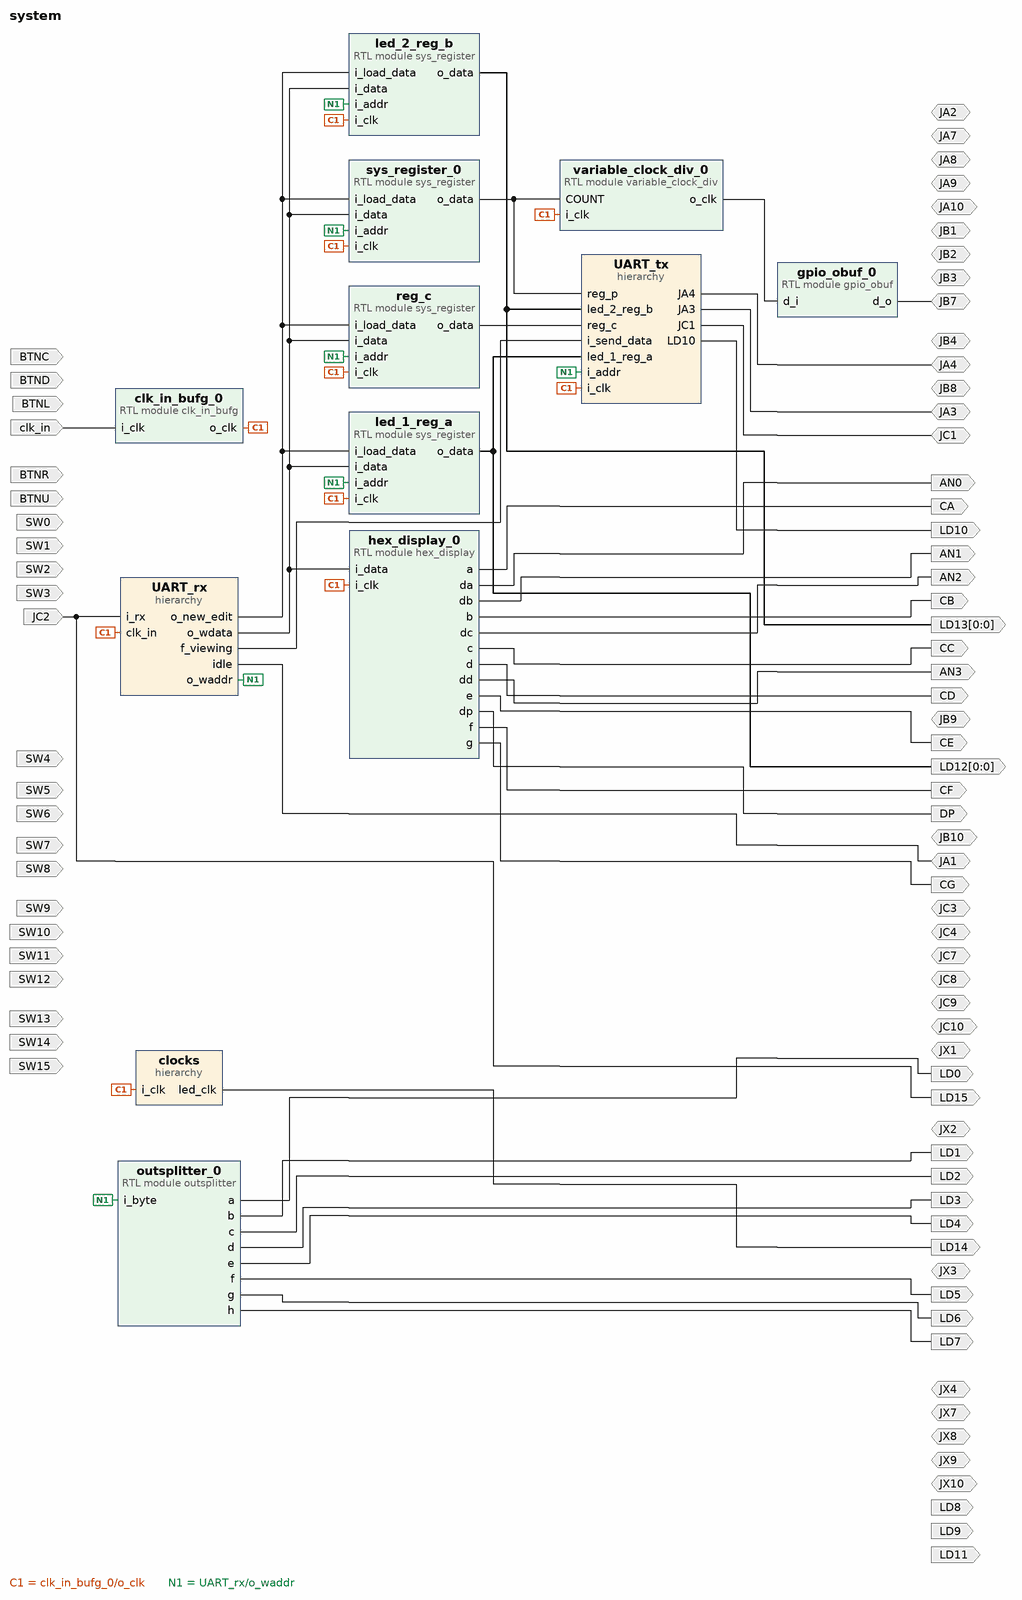
[diagram p0: block diagram of the top level]
# Vivado block design system, xc7a35tcpg236-1, Vivado 2022.1
create_bd_design system

create_bd_port -dir I BTNL
create_bd_port -dir I BTNR
create_bd_port -dir I BTNU
create_bd_port -dir I BTND
create_bd_port -dir I BTNC
create_bd_port -dir I SW0
create_bd_port -dir I SW1
create_bd_port -dir I SW2
create_bd_port -dir I SW3
create_bd_port -dir I SW4
create_bd_port -dir I SW5
create_bd_port -dir I SW6
create_bd_port -dir I SW7
create_bd_port -dir I SW8
create_bd_port -dir I SW9
create_bd_port -dir I SW10
create_bd_port -dir I SW11
create_bd_port -dir I SW12
create_bd_port -dir I SW13
create_bd_port -dir I SW14
create_bd_port -dir I SW15
create_bd_port -dir O AN0
create_bd_port -dir O AN1
create_bd_port -dir O AN2
create_bd_port -dir O AN3
create_bd_port -dir O CA
create_bd_port -dir O CB
create_bd_port -dir O CC
create_bd_port -dir O CD
create_bd_port -dir O CE
create_bd_port -dir O CF
create_bd_port -dir O CG
create_bd_port -dir O DP
create_bd_port -dir O LD0
create_bd_port -dir O LD1
create_bd_port -dir O LD2
create_bd_port -dir O LD3
create_bd_port -dir O LD4
create_bd_port -dir O LD5
create_bd_port -dir O LD6
create_bd_port -dir O LD7
create_bd_port -dir O LD8
create_bd_port -dir O LD9
create_bd_port -dir O LD10
create_bd_port -dir O LD11
create_bd_port -dir O -from 0 -to 0 LD12
create_bd_port -dir O -from 0 -to 0 LD13
create_bd_port -dir O LD14
create_bd_port -dir O LD15
create_bd_port -dir IO JA1
create_bd_port -dir IO JA2
create_bd_port -dir IO JA3
create_bd_port -dir IO JA4
create_bd_port -dir IO JA7
create_bd_port -dir IO JA8
create_bd_port -dir IO JA9
create_bd_port -dir IO JA10
create_bd_port -dir IO JB1
create_bd_port -dir IO JB2
create_bd_port -dir IO JB3
create_bd_port -dir IO JB4
create_bd_port -dir IO JB7
create_bd_port -dir IO JB8
create_bd_port -dir IO JB9
create_bd_port -dir IO JB10
create_bd_port -dir IO JC1
create_bd_port -dir IO JC3
create_bd_port -dir IO JC4
create_bd_port -dir IO JC7
create_bd_port -dir IO JC8
create_bd_port -dir IO JC9
create_bd_port -dir IO JC10
create_bd_port -dir IO JX1
create_bd_port -dir IO JX2
create_bd_port -dir IO JX3
create_bd_port -dir IO JX4
create_bd_port -dir IO JX7
create_bd_port -dir IO JX8
create_bd_port -dir IO JX9
create_bd_port -dir IO JX10
create_bd_port -dir I clk_in
create_bd_port -dir I JC2

create_bd_cell -type module -reference clk_in_bufg clk_in_bufg_0
create_bd_cell -type hier clocks
create_bd_cell -type hier UART_rx
create_bd_cell -type module -reference outsplitter outsplitter_0
create_bd_cell -type module -reference hex_display hex_display_0
create_bd_cell -type module -reference sys_register led_1_reg_a
set_property -dict {CONFIG.ADDR 97 CONFIG.OUTWIDTH 1} [get_bd_cells led_1_reg_a]
create_bd_cell -type module -reference sys_register led_2_reg_b
set_property -dict {CONFIG.ADDR 98 CONFIG.OUTWIDTH 1} [get_bd_cells led_2_reg_b]
create_bd_cell -type module -reference sys_register reg_c
set_property -dict {CONFIG.ADDR 99} [get_bd_cells reg_c]
create_bd_cell -type hier UART_tx
create_bd_cell -type module -reference sys_register sys_register_0
set_property -dict {CONFIG.ADDR 112 CONFIG.OUTWIDTH 32} [get_bd_cells sys_register_0]
create_bd_cell -type module -reference variable_clock_div variable_clock_div_0
set_property -dict {CONFIG.COUNT_WIDTH 32} [get_bd_cells variable_clock_div_0]
create_bd_cell -type module -reference gpio_obuf gpio_obuf_0

# ---- hierarchy /clocks ----
current_bd_instance /clocks
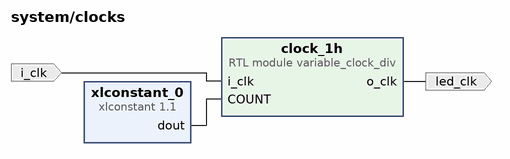
[diagram p1: block diagram inside /clocks]
create_bd_pin -dir I -type clk i_clk
create_bd_pin -dir O -type clk led_clk

create_bd_cell -type ip -vlnv xilinx.com:ip:xlconstant:1.1 xlconstant_0
set_property -dict {CONFIG.CONST_VAL 50000000 CONFIG.CONST_WIDTH 26} [get_bd_cells xlconstant_0]
create_bd_cell -type module -reference variable_clock_div clock_1h
set_property -dict {CONFIG.COUNT_WIDTH 26} [get_bd_cells clock_1h]

# ---- hierarchy /UART_rx ----
current_bd_instance /UART_rx
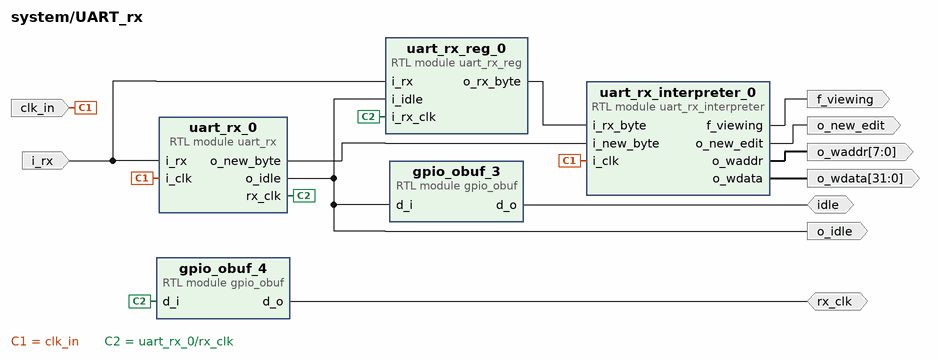
[diagram p2: block diagram inside /UART_rx]
create_bd_pin -dir I -type clk clk_in
create_bd_pin -dir I i_rx
create_bd_pin -dir IO rx_clk
create_bd_pin -dir IO idle
create_bd_pin -dir O o_idle
create_bd_pin -dir O o_new_edit
create_bd_pin -dir O -from 7 -to 0 o_waddr
create_bd_pin -dir O -from 31 -to 0 o_wdata
create_bd_pin -dir O f_viewing

create_bd_cell -type module -reference gpio_obuf gpio_obuf_4
create_bd_cell -type module -reference gpio_obuf gpio_obuf_3
create_bd_cell -type module -reference uart_rx uart_rx_0
create_bd_cell -type module -reference uart_rx_reg uart_rx_reg_0
create_bd_cell -type module -reference uart_rx_interpreter uart_rx_interpreter_0

# ---- hierarchy /UART_tx ----
current_bd_instance /UART_tx
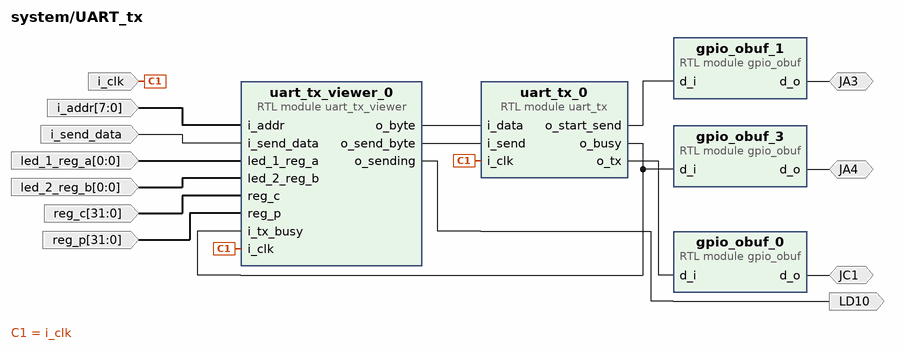
[diagram p3: block diagram inside /UART_tx]
create_bd_pin -dir I i_send_data
create_bd_pin -dir I -from 7 -to 0 i_addr
create_bd_pin -dir I -from 0 -to 0 led_1_reg_a
create_bd_pin -dir I -from 0 -to 0 led_2_reg_b
create_bd_pin -dir I -from 31 -to 0 reg_c
create_bd_pin -dir I -type clk i_clk
create_bd_pin -dir O LD10
create_bd_pin -dir IO JA4
create_bd_pin -dir IO JA3
create_bd_pin -dir IO JC1
create_bd_pin -dir I -from 31 -to 0 reg_p

create_bd_cell -type module -reference uart_tx uart_tx_0
create_bd_cell -type module -reference gpio_obuf gpio_obuf_3
create_bd_cell -type module -reference gpio_obuf gpio_obuf_1
create_bd_cell -type module -reference gpio_obuf gpio_obuf_0
create_bd_cell -type module -reference uart_tx_viewer uart_tx_viewer_0

# ---- connections ----

current_bd_instance /clocks
connect_bd_net [get_bd_pins i_clk] [get_bd_pins clock_1h/i_clk]
connect_bd_net -net variable_clock_div_1_o_clk [get_bd_pins clock_1h/o_clk] [get_bd_pins led_clk]
connect_bd_net [get_bd_pins xlconstant_0/dout] [get_bd_pins clock_1h/COUNT]

current_bd_instance /UART_rx
connect_bd_net -net JC2_1 [get_bd_pins i_rx] [get_bd_pins uart_rx_0/i_rx] [get_bd_pins uart_rx_reg_0/i_rx]
connect_bd_net [get_bd_pins rx_clk] [get_bd_pins gpio_obuf_4/d_o]
connect_bd_net [get_bd_pins idle] [get_bd_pins gpio_obuf_3/d_o]
connect_bd_net [get_bd_pins clk_in] [get_bd_pins uart_rx_0/i_clk] [get_bd_pins uart_rx_interpreter_0/i_clk]
connect_bd_net [get_bd_pins uart_rx_0/o_idle] [get_bd_pins gpio_obuf_3/d_i] [get_bd_pins o_idle] [get_bd_pins uart_rx_reg_0/i_idle]
connect_bd_net [get_bd_pins uart_rx_0/o_new_byte] [get_bd_pins uart_rx_interpreter_0/i_new_byte]
connect_bd_net [get_bd_pins uart_rx_0/rx_clk] [get_bd_pins gpio_obuf_4/d_i] [get_bd_pins uart_rx_reg_0/i_rx_clk]
connect_bd_net [get_bd_pins uart_rx_interpreter_0/f_viewing] [get_bd_pins f_viewing]
connect_bd_net [get_bd_pins uart_rx_interpreter_0/o_new_edit] [get_bd_pins o_new_edit]
connect_bd_net [get_bd_pins uart_rx_interpreter_0/o_waddr] [get_bd_pins o_waddr]
connect_bd_net [get_bd_pins uart_rx_interpreter_0/o_wdata] [get_bd_pins o_wdata]
connect_bd_net [get_bd_pins uart_rx_reg_0/o_rx_byte] [get_bd_pins uart_rx_interpreter_0/i_rx_byte]

current_bd_instance /UART_tx
connect_bd_net [get_bd_pins JA4] [get_bd_pins gpio_obuf_3/d_o]
connect_bd_net [get_bd_pins JA3] [get_bd_pins gpio_obuf_1/d_o]
connect_bd_net [get_bd_pins JC1] [get_bd_pins gpio_obuf_0/d_o]
connect_bd_net [get_bd_pins i_addr] [get_bd_pins uart_tx_viewer_0/i_addr]
connect_bd_net [get_bd_pins i_clk] [get_bd_pins uart_tx_0/i_clk] [get_bd_pins uart_tx_viewer_0/i_clk]
connect_bd_net [get_bd_pins i_send_data] [get_bd_pins uart_tx_viewer_0/i_send_data]
connect_bd_net [get_bd_pins led_1_reg_a] [get_bd_pins uart_tx_viewer_0/led_1_reg_a]
connect_bd_net [get_bd_pins led_2_reg_b] [get_bd_pins uart_tx_viewer_0/led_2_reg_b]
connect_bd_net [get_bd_pins reg_c] [get_bd_pins uart_tx_viewer_0/reg_c]
connect_bd_net [get_bd_pins reg_p] [get_bd_pins uart_tx_viewer_0/reg_p]
connect_bd_net [get_bd_pins uart_tx_0/o_busy] [get_bd_pins gpio_obuf_3/d_i] [get_bd_pins uart_tx_viewer_0/i_tx_busy]
connect_bd_net [get_bd_pins uart_tx_0/o_start_send] [get_bd_pins gpio_obuf_1/d_i]
connect_bd_net [get_bd_pins uart_tx_0/o_tx] [get_bd_pins gpio_obuf_0/d_i]
connect_bd_net [get_bd_pins uart_tx_viewer_0/o_byte] [get_bd_pins uart_tx_0/i_data]
connect_bd_net [get_bd_pins uart_tx_viewer_0/o_send_byte] [get_bd_pins uart_tx_0/i_send]
connect_bd_net [get_bd_pins uart_tx_viewer_0/o_sending] [get_bd_pins LD10]

current_bd_instance /
connect_bd_net [get_bd_ports JB7] [get_bd_pins gpio_obuf_0/d_o]
connect_bd_net [get_bd_ports JA4] [get_bd_pins UART_tx/JA4]
connect_bd_net [get_bd_ports JA1] [get_bd_pins UART_rx/idle]
connect_bd_net [get_bd_ports JC1] [get_bd_pins UART_tx/JC1]
connect_bd_net [get_bd_ports JA3] [get_bd_pins UART_tx/JA3]
connect_bd_net [get_bd_pins UART_rx/f_viewing] [get_bd_pins UART_tx/i_send_data]
connect_bd_net [get_bd_pins UART_tx/LD10] [get_bd_ports LD10]
connect_bd_net [get_bd_ports clk_in] [get_bd_pins clk_in_bufg_0/i_clk]
connect_bd_net [get_bd_pins clk_in_bufg_0/o_clk] \
  [get_bd_pins clocks/i_clk] [get_bd_pins UART_rx/clk_in] [get_bd_pins hex_display_0/i_clk] [get_bd_pins led_1_reg_a/i_clk] \
  [get_bd_pins led_2_reg_b/i_clk] [get_bd_pins reg_c/i_clk] [get_bd_pins UART_tx/i_clk] [get_bd_pins sys_register_0/i_clk] \
  [get_bd_pins variable_clock_div_0/i_clk]
connect_bd_net -net clocks_LD2 [get_bd_pins clocks/led_clk] [get_bd_ports LD14]
connect_bd_net -net gpio_input_0_data_out [get_bd_ports JC2] [get_bd_ports LD15] [get_bd_pins UART_rx/i_rx]
connect_bd_net [get_bd_pins hex_display_0/a] [get_bd_ports CA]
connect_bd_net [get_bd_pins hex_display_0/b] [get_bd_ports CB]
connect_bd_net [get_bd_pins hex_display_0/c] [get_bd_ports CC]
connect_bd_net [get_bd_pins hex_display_0/d] [get_bd_ports CD]
connect_bd_net [get_bd_pins hex_display_0/da] [get_bd_ports AN0]
connect_bd_net [get_bd_pins hex_display_0/db] [get_bd_ports AN1]
connect_bd_net [get_bd_pins hex_display_0/dc] [get_bd_ports AN2]
connect_bd_net [get_bd_pins hex_display_0/dd] [get_bd_ports AN3]
connect_bd_net [get_bd_pins hex_display_0/dp] [get_bd_ports DP]
connect_bd_net [get_bd_pins hex_display_0/e] [get_bd_ports CE]
connect_bd_net [get_bd_pins hex_display_0/f] [get_bd_ports CF]
connect_bd_net [get_bd_pins hex_display_0/g] [get_bd_ports CG]
connect_bd_net [get_bd_pins outsplitter_0/a] [get_bd_ports LD0]
connect_bd_net [get_bd_pins outsplitter_0/b] [get_bd_ports LD1]
connect_bd_net [get_bd_pins outsplitter_0/c] [get_bd_ports LD2]
connect_bd_net [get_bd_pins outsplitter_0/d] [get_bd_ports LD3]
connect_bd_net [get_bd_pins outsplitter_0/e] [get_bd_ports LD4]
connect_bd_net [get_bd_pins outsplitter_0/f] [get_bd_ports LD5]
connect_bd_net [get_bd_pins outsplitter_0/g] [get_bd_ports LD6]
connect_bd_net [get_bd_pins outsplitter_0/h] [get_bd_ports LD7]
connect_bd_net [get_bd_pins reg_c/o_data] [get_bd_pins UART_tx/reg_c]
connect_bd_net -net sys_register_0_o_data [get_bd_pins led_1_reg_a/o_data] [get_bd_ports LD12] [get_bd_pins UART_tx/led_1_reg_a]
connect_bd_net [get_bd_pins sys_register_0/o_data] [get_bd_pins variable_clock_div_0/COUNT] [get_bd_pins UART_tx/reg_p]
connect_bd_net -net sys_register_1_o_data [get_bd_pins led_2_reg_b/o_data] [get_bd_ports LD13] [get_bd_pins UART_tx/led_2_reg_b]
connect_bd_net -net uart_rx_interpreter_0_o_new_edit [get_bd_pins UART_rx/o_new_edit] \
  [get_bd_pins led_1_reg_a/i_load_data] [get_bd_pins led_2_reg_b/i_load_data] [get_bd_pins reg_c/i_load_data] \
  [get_bd_pins sys_register_0/i_load_data]
connect_bd_net -net uart_rx_interpreter_0_o_waddr [get_bd_pins UART_rx/o_waddr] \
  [get_bd_pins outsplitter_0/i_byte] [get_bd_pins led_1_reg_a/i_addr] [get_bd_pins led_2_reg_b/i_addr] \
  [get_bd_pins reg_c/i_addr] [get_bd_pins UART_tx/i_addr] [get_bd_pins sys_register_0/i_addr]
connect_bd_net -net uart_rx_interpreter_0_o_wdata [get_bd_pins UART_rx/o_wdata] \
  [get_bd_pins hex_display_0/i_data] [get_bd_pins led_1_reg_a/i_data] [get_bd_pins led_2_reg_b/i_data] \
  [get_bd_pins reg_c/i_data] [get_bd_pins sys_register_0/i_data]
connect_bd_net [get_bd_pins variable_clock_div_0/o_clk] [get_bd_pins gpio_obuf_0/d_i]

validate_bd_design
save_bd_design
